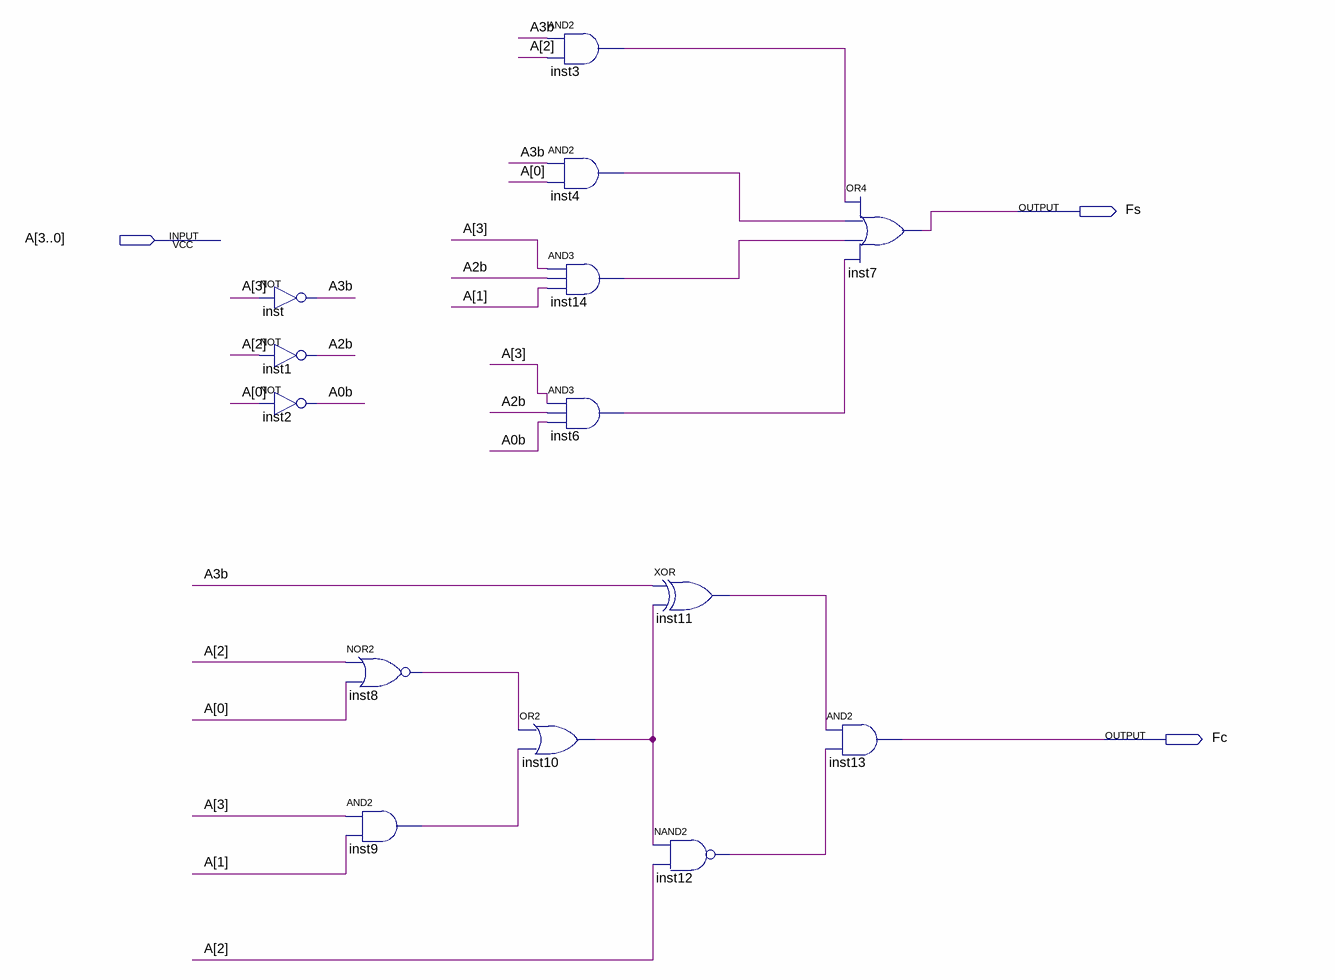
[diagram p0: schematic sheet]
// Quartus schematic q2.bdf as structural Verilog: 14 symbols, 3 pins
module q2 (
  input  [3:0] A,
  output Fs,
  output Fc
);

  wire A0b, A2b, A3b, inst3_out, inst4_out, inst6_out, inst8_out, inst9_out, inst10_out, inst11_out,
       inst12_out, inst14_out;

  not inst (A3b, A[3]);
  not inst1 (A2b, A[2]);
  not inst2 (A0b, A[0]);
  nor inst8 (inst8_out, A[2], A[0]);
  and inst9 (inst9_out, A[3], A[1]);
  and inst3 (inst3_out, A3b, A[2]);
  and inst4 (inst4_out, A3b, A[0]);
  and inst14 (inst14_out, A[3], A2b, A[1]);
  and inst6 (inst6_out, A[3], A2b, A0b);
  or inst10 (inst10_out, inst8_out, inst9_out);
  xor inst11 (inst11_out, A3b, inst10_out);
  nand inst12 (inst12_out, inst10_out, A[2]);
  or inst7 (Fs, inst3_out, inst4_out, inst14_out, inst6_out);
  and inst13 (Fc, inst11_out, inst12_out);
endmodule
